# Altium schematic sheet Power.SchDoc
size A4
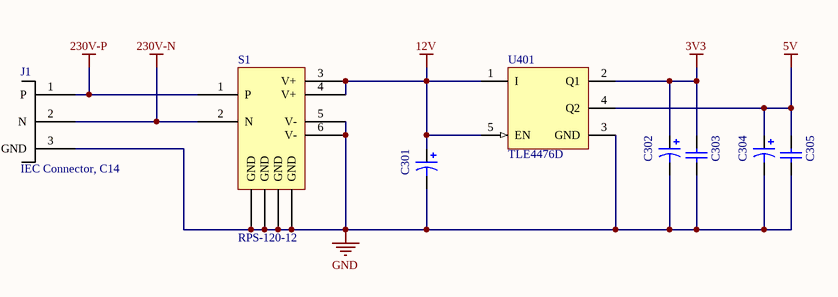
[diagram p0: Power.SchDoc]

## Parts
C301  T491B  [B]  (value not drawn)
C302  T491B  [B]  (value not drawn)
C303  CAP 100nF 10V 1206(3216)  [CAPC1206(3216)190_N]  (value not drawn)
C304  T491B  [B]  (value not drawn)
C305  CAP 100nF 10V 1206(3216)  [CAPC1206(3216)190_N]  (value not drawn)
J1  IEC Connector, C14  [PX0580]
S1  RPS-120-12  [RPS-120-12]
U401  TLE4476D  [INF-PG-TO252-5-11_M]

## Nets
3V3: C302.1 C303.2 U401.2(Q1)
5V: C304.1 C305.2 U401.4(Q2)
12V: C301.1 S1.3(V+) S1.4(V+) U401.1(I) U401.5(EN)
230V-N: J1.2(N) S1.2(N)
230V-P: J1.1(P) S1.1(P)
GND: C301.2 C302.2 C303.1 C304.2 C305.1 J1.3(GND) S1.5(V-) S1.6(V-) S1.H1(GND) S1.H2(GND) S1.H3(GND) S1.H4(GND) U401.3(GND)

## Library data of the parts
C301 C302 C304 = T491B: Solid Tantalum Chip Capacitor, Standard T491 Series - Industrial Grade; Value: 100pF; Published: 17-Jul-2002; LatestRevisionDate: 19-Mar-2004; LatestRevisionNote: Silkscreen dimensions re-sized.; DatasheetDocument: Mar-2001; PackageDocument: Mar-2001; PackageReference: B; Publisher: Altium Limited; Code_JEITA: 3528-21; ComponentLink1Description: Manufacturer Link; ComponentLink1URL: http://www.kemet.com/; ComponentLink2Description: Datasheet; ComponentLink2URL: http://www.kemet.com/kemet/web/homepage/kechome.nsf/vapubfilesname/F3102TA.pdf/$file/F3102TA.pdf
C303 C305 = CMP-1037-04171-1: CAP 100nF 10V ±5% 1206 (3216 Metric) Thickness 1.9mm SMD; Tolerance: Â±5%; Case-Metric: 3216; Case-EIA: 1206; Value: 100nF; Rated Voltage: 10 V; Technology: SMT; Max Thickness: 1.9 mm
J1 = PX0580/PC/12132: IEC C14, Right Angle Male, Mounting Holes; Ref: PX0580/PC/12132
S1 = RPS-120-12: Power supply, 120 W, 12V/10A, unenclosed; Ref: RPS-120-12
U401 = CMP-1109-00149-1: Dual Low Drop Voltage Regulator, 4.5 to 42 V / 5.7 to 42 V Supply, 3.3 V 5 V Output, -40 to 150 degC, PG-TO252-5-11, Reel, Green; Manufacturer: Infineon; Typical Quiescent Current: 300 uA; Regulator Type: multiple output; Max. Output Current: 350 mA 430 mA; Operating Range: 4.5 to 42 V 5.7 to 42 V; Dropout Voltage: 1200 mV 300 mV; Accuracy: 4 % 4 %; Green: TRUE; Output Voltage: 3.3V 5V; ComponentLink1Description: Manufacturer URL; ComponentLink3URL: http://www.infineon.com/dgdl/TLE7276-Data+Sheet-+v1_11.pdf?folderId=db3a304412b407950112b408e8c90004&fileId=db3a304412b407950112b436c53f66c8&sId=db3a30433db6f09f013dc0e43c0428c1; ComponentLink2URL: http://www.infineon.com/dgdl/TLE4476_DS_25%5B1%5D.pdf?folderId=db3a304318f3fe290118f5a433570040&fileId=db3a30431c48a312011c55e0456c0243&location=en.Products.Automotive_ICs.Linear_Voltage_Regulators_for_Automotive-Applications.Linear_Voltage_Regulators_-_Se; ComponentLink1URL: http://www.infineon.com/; PackageReference: PG-TO252-5-11; PackageDescription: 5-Pin Plastic (Green) Transistor Single Outline Package, 6.5 x 6.12 mm Body, 1.14 mm Pitch; ComponentLink2Description: Datasheet; PackageVersion: Nov-10; PartNumber: TLE4476D; Packing: Reel; Mounting Technology: Surface Mount; DatasheetVersion: Rev. 2.5; Halogen-free: TRUE; ComponentLink3Description: Package Specification